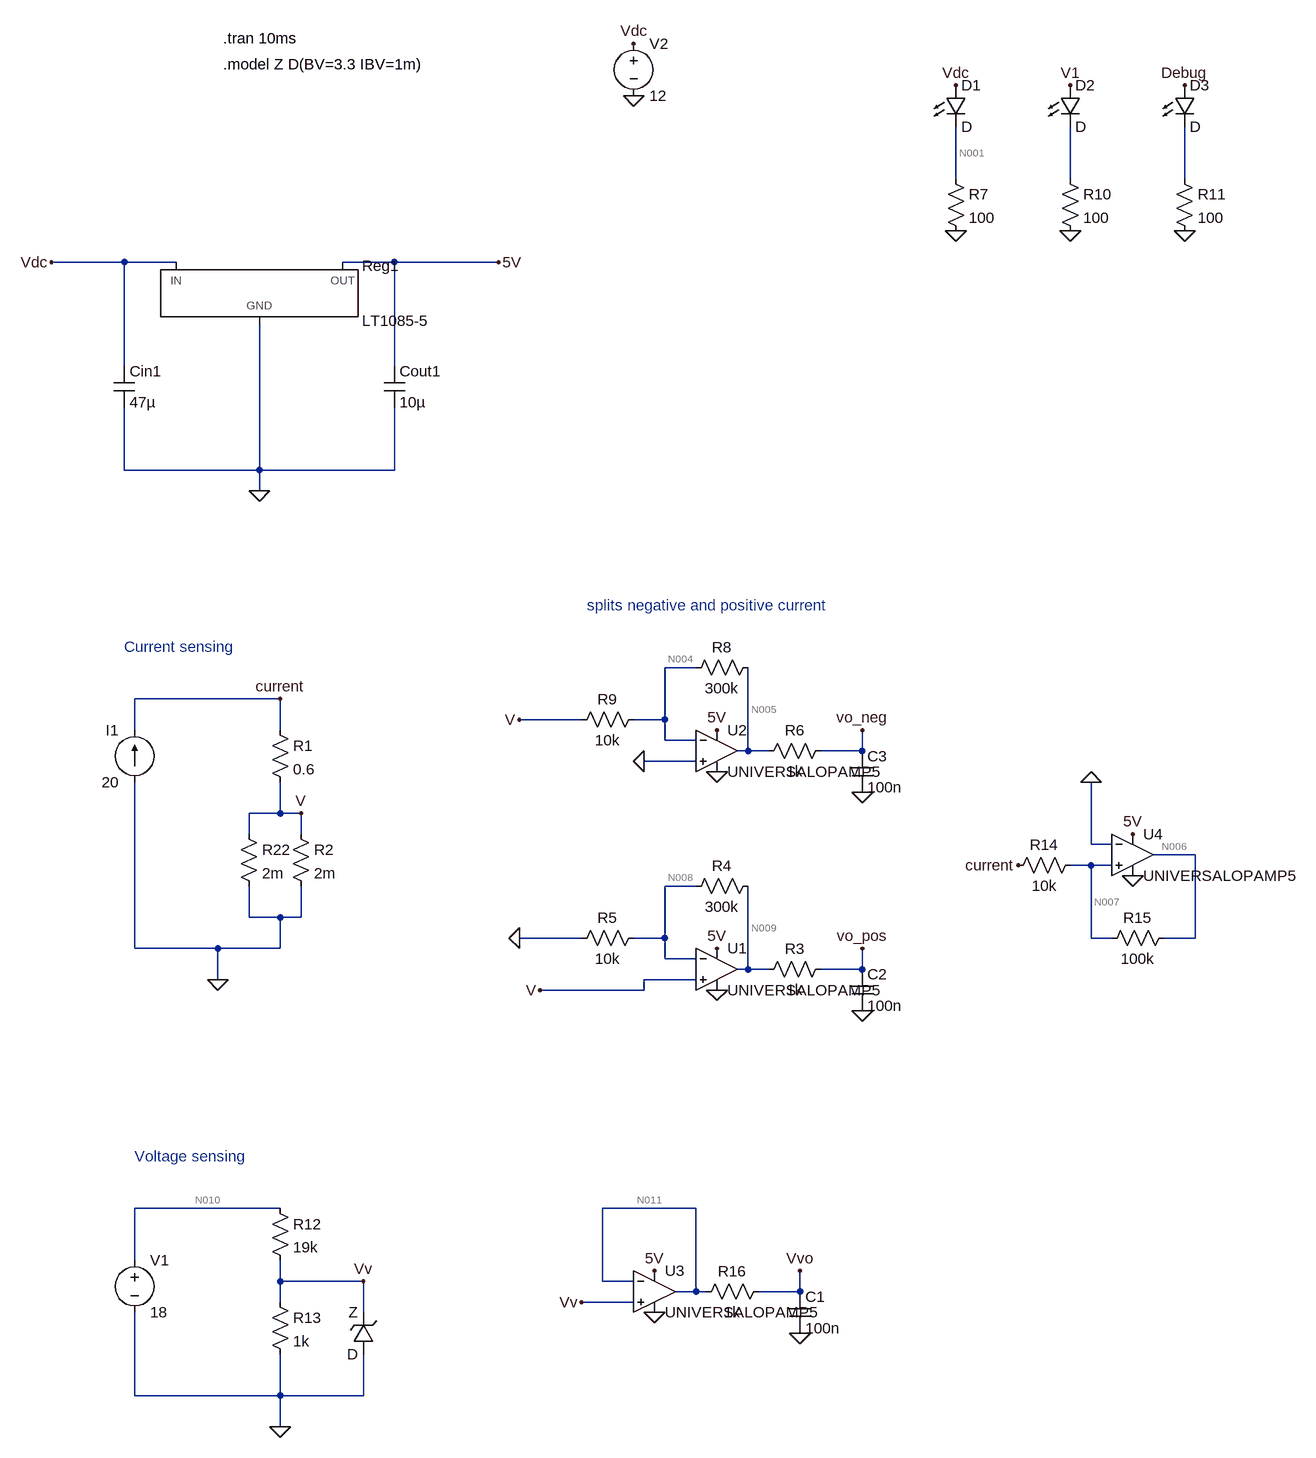
[diagram p0: schematic Splits_negative_positive.asc]
Splits_negative_positive.asc, the LTspice schematic file:
Version 4
SHEET 1 2388 1060
WIRE 688 -880 688 -960
WIRE 864 -880 864 -960
WIRE 1040 -880 1040 -960
WIRE -592 -752 -704 -752
WIRE -512 -752 -592 -752
WIRE -176 -752 -256 -752
WIRE -16 -752 -176 -752
WIRE -592 -592 -592 -752
WIRE -176 -592 -176 -752
WIRE -592 -432 -592 -528
WIRE -384 -432 -384 -656
WIRE -384 -432 -592 -432
WIRE -176 -432 -176 -528
WIRE -176 -432 -384 -432
WIRE -384 -400 -384 -432
WIRE 288 -128 240 -128
WIRE -352 -80 -576 -80
WIRE 112 -48 16 -48
WIRE 240 -48 240 -128
WIRE 240 -48 192 -48
WIRE -576 -32 -576 -80
WIRE -352 -32 -352 -80
WIRE 240 -16 240 -48
WIRE 288 -16 240 -16
WIRE 368 0 368 -128
WIRE 368 0 352 0
WIRE 400 0 368 0
WIRE 544 0 544 -32
WIRE 544 0 480 0
WIRE 288 16 208 16
WIRE -352 96 -352 48
WIRE -352 96 -400 96
WIRE -320 96 -352 96
WIRE -400 128 -400 96
WIRE -320 128 -320 96
WIRE 896 144 896 48
WIRE 928 144 896 144
WIRE 1056 160 992 160
WIRE 896 176 864 176
WIRE 928 176 896 176
WIRE 288 208 240 208
WIRE -400 256 -400 208
WIRE -352 256 -400 256
WIRE -320 256 -320 208
WIRE -320 256 -352 256
WIRE 112 288 16 288
WIRE 240 288 240 208
WIRE 240 288 192 288
WIRE 896 288 896 176
WIRE 928 288 896 288
WIRE 1056 288 1056 160
WIRE 1056 288 1008 288
WIRE -576 304 -576 48
WIRE -448 304 -576 304
WIRE -352 304 -352 256
WIRE -352 304 -448 304
WIRE 240 320 240 288
WIRE 288 320 240 320
WIRE 368 336 368 208
WIRE 368 336 352 336
WIRE 400 336 368 336
WIRE 544 336 544 304
WIRE 544 336 480 336
WIRE -448 352 -448 304
WIRE 288 352 208 352
WIRE 208 368 208 352
WIRE 208 368 48 368
WIRE -352 704 -576 704
WIRE 288 704 144 704
WIRE -576 784 -576 704
WIRE -352 816 -352 784
WIRE -224 816 -352 816
WIRE 144 816 144 704
WIRE 192 816 144 816
WIRE 288 832 288 704
WIRE 288 832 256 832
WIRE 304 832 288 832
WIRE 448 832 448 800
WIRE 448 832 384 832
WIRE -352 848 -352 816
WIRE 192 848 112 848
WIRE -224 864 -224 816
WIRE -576 992 -576 864
WIRE -352 992 -352 928
WIRE -352 992 -576 992
WIRE -224 992 -224 928
WIRE -224 992 -352 992
WIRE -352 1040 -352 992
FLAG -448 352 0
FLAG -320 96 V
FLAG 16 288 0
FLAG 48 368 V
FLAG 320 368 0
FLAG 320 304 5V
FLAG 544 304 vo_pos
FLAG 320 32 0
FLAG 320 -32 5V
FLAG 544 -32 vo_neg
FLAG -224 816 Vv
FLAG 112 848 Vv
FLAG 224 864 0
FLAG 224 800 5V
FLAG 448 896 0
FLAG 448 800 Vvo
FLAG 208 16 0
FLAG 16 -48 V
FLAG 544 400 0
FLAG 544 64 0
FLAG -16 -752 5V
FLAG -704 -752 Vdc
FLAG 192 -1008 0
FLAG 192 -1088 Vdc
FLAG -384 -400 0
FLAG -352 1040 0
FLAG 688 -800 0
FLAG 688 -1024 Vdc
FLAG 864 -800 0
FLAG 864 -1024 V1
FLAG 1040 -800 0
FLAG 1040 -1024 Debug
FLAG 960 192 0
FLAG 960 128 5V
FLAG 896 48 0
FLAG 784 176 current
FLAG -352 -80 current
SYMBOL voltage -576 768 R0
WINDOW 123 0 0 Left 0
WINDOW 39 0 0 Left 0
SYMATTR InstName V1
SYMATTR Value 18
SYMBOL res -368 -48 R0
SYMATTR InstName R1
SYMATTR Value 0.6
SYMBOL res -336 112 R0
SYMATTR InstName R2
SYMATTR Value 2m
SYMBOL res 384 192 R90
WINDOW 0 0 56 VBottom 2
WINDOW 3 32 56 VTop 2
SYMATTR InstName R4
SYMATTR Value 300k
SYMBOL res 208 272 R90
WINDOW 0 0 56 VBottom 2
WINDOW 3 32 56 VTop 2
SYMATTR InstName R5
SYMATTR Value 10k
SYMBOL OpAmps\\UniversalOpAmp5 320 336 R0
SYMATTR InstName U1
SYMBOL res 384 -144 R90
WINDOW 0 0 56 VBottom 2
WINDOW 3 32 56 VTop 2
SYMATTR InstName R8
SYMATTR Value 300k
SYMBOL res 208 -64 R90
WINDOW 0 0 56 VBottom 2
WINDOW 3 32 56 VTop 2
SYMATTR InstName R9
SYMATTR Value 10k
SYMBOL OpAmps\\UniversalOpAmp5 320 0 R0
SYMATTR InstName U2
SYMBOL res -368 688 R0
SYMATTR InstName R12
SYMATTR Value 19k
SYMBOL res -368 832 R0
SYMATTR InstName R13
SYMATTR Value 1k
SYMBOL OpAmps\\UniversalOpAmp5 224 832 R0
SYMATTR InstName U3
SYMBOL res 400 816 R90
WINDOW 0 0 56 VBottom 2
WINDOW 3 32 56 VTop 2
SYMATTR InstName R16
SYMATTR Value 1k
SYMBOL cap 432 832 R0
SYMATTR InstName C1
SYMATTR Value 100n
SYMBOL res -416 112 R0
SYMATTR InstName R22
SYMATTR Value 2m
SYMBOL zener -208 928 R180
WINDOW 0 24 64 Left 2
WINDOW 3 24 0 Left 2
SYMATTR InstName Z
SYMBOL current -576 48 R180
WINDOW 0 24 80 Left 2
WINDOW 3 24 0 Left 2
WINDOW 123 0 0 Left 0
WINDOW 39 0 0 Left 0
SYMATTR InstName I1
SYMATTR Value 20
SYMBOL res 496 320 R90
WINDOW 0 0 56 VBottom 2
WINDOW 3 32 56 VTop 2
SYMATTR InstName R3
SYMATTR Value 1k
SYMBOL cap 528 336 R0
SYMATTR InstName C2
SYMATTR Value 100n
SYMBOL res 496 -16 R90
WINDOW 0 0 56 VBottom 2
WINDOW 3 32 56 VTop 2
SYMATTR InstName R6
SYMATTR Value 1k
SYMBOL cap 528 0 R0
SYMATTR InstName C3
SYMATTR Value 100n
SYMBOL PowerProducts/LT1085-5 -384 -752 R0
SYMATTR InstName Reg1
SYMBOL cap -608 -592 R0
SYMATTR InstName Cin1
SYMATTR Value 47µ
SYMATTR SpiceLine Rser=0.001
SYMBOL cap -192 -592 R0
SYMATTR InstName Cout1
SYMATTR Value 10µ
SYMATTR SpiceLine Rser=0.001
SYMBOL voltage 192 -1104 R0
WINDOW 123 0 0 Left 0
WINDOW 39 0 0 Left 0
SYMATTR InstName V2
SYMATTR Value 12
SYMBOL LED 672 -1024 R0
SYMATTR InstName D1
SYMBOL res 672 -896 R0
SYMATTR InstName R7
SYMATTR Value 100
SYMBOL LED 848 -1024 R0
SYMATTR InstName D2
SYMBOL res 848 -896 R0
SYMATTR InstName R10
SYMATTR Value 100
SYMBOL LED 1024 -1024 R0
SYMATTR InstName D3
SYMBOL res 1024 -896 R0
SYMATTR InstName R11
SYMATTR Value 100
SYMBOL OpAmps\\UniversalOpAmp5 960 160 R0
SYMATTR InstName U4
SYMBOL res 880 160 R90
WINDOW 0 0 56 VBottom 2
WINDOW 3 32 56 VTop 2
SYMATTR InstName R14
SYMATTR Value 10k
SYMBOL res 1024 272 R90
WINDOW 0 0 56 VBottom 2
WINDOW 3 32 56 VTop 2
SYMATTR InstName R15
SYMATTR Value 100k
TEXT -440 -1096 Left 2 !.tran 10ms
TEXT 120 -224 Left 2 ;splits negative and positive current
TEXT -440 -1056 Left 2 !.model Z D(BV=3.3 IBV=1m)
TEXT -576 624 Left 2 ;Voltage sensing
TEXT -592 -160 Left 2 ;Current sensing

The netlist it stands for:
* Splits_negative_positive.asc
V1 N010 0 18
R1 current V 0.6
R2 V 0 2m
R4 N009 N008 300k
R5 N008 0 10k
XU1 V N008 5V 0 N009 level5 Avol=1Meg GBW=10Meg Phimargin=45 SlewPos=10Meg SlewNeg=10Meg En=0 Enk=0 In=0 Ink=0 Rcm=500Meg Ccm=1p Rdiff=500k Cdiff=2p Ro=1k Vos=0 Ibp=2n Ibn=1n Iq=1m Rail=0 Ilimit=25m  ; UNIVERSALOPAMP5, pins In+ In- V+ V- OUT
R8 N005 N004 300k
R9 N004 V 10k
XU2 0 N004 5V 0 N005 level5 Avol=1Meg GBW=10Meg Phimargin=45 SlewPos=10Meg SlewNeg=10Meg En=0 Enk=0 In=0 Ink=0 Rcm=500Meg Ccm=1p Rdiff=500k Cdiff=2p Ro=1k Vos=0 Ibp=2n Ibn=1n Iq=1m Rail=0 Ilimit=25m  ; UNIVERSALOPAMP5, pins In+ In- V+ V- OUT
R12 N010 Vv 19k
R13 Vv 0 1k
XU3 Vv N011 5V 0 N011 level5 Avol=1Meg GBW=10Meg Phimargin=45 SlewPos=10Meg SlewNeg=10Meg En=0 Enk=0 In=0 Ink=0 Rcm=500Meg Ccm=1p Rdiff=500k Cdiff=2p Ro=1k Vos=0 Ibp=2n Ibn=1n Iq=1m Rail=0 Ilimit=25m  ; UNIVERSALOPAMP5, pins In+ In- V+ V- OUT
R16 Vvo N011 1k
C1 Vvo 0 100n
R22 V 0 2m
D§Z 0 Vv D
I1 0 current 20
R3 vo_pos N009 1k
C2 vo_pos 0 100n
R6 vo_neg N005 1k
C3 vo_neg 0 100n
XReg1 0 5V Vdc LT1085-5  ; pins GND OUT IN
Cin1 Vdc 0 47µ Rser=0.001
Cout1 5V 0 10µ Rser=0.001
V2 Vdc 0 12
D1 Vdc N001 D
R7 N001 0 100
D2 V1 N002 D
R10 N002 0 100
D3 Debug N003 D
R11 N003 0 100
XU4 N007 0 5V 0 N006 level5 Avol=1Meg GBW=10Meg Phimargin=45 SlewPos=10Meg SlewNeg=10Meg En=0 Enk=0 In=0 Ink=0 Rcm=500Meg Ccm=1p Rdiff=500k Cdiff=2p Ro=1k Vos=0 Ibp=2n Ibn=1n Iq=1m Rail=0 Ilimit=25m  ; UNIVERSALOPAMP5, pins In+ In- V+ V- OUT
R14 N007 current 10k
R15 N006 N007 100k
.model D D
.lib standard.dio
.tran 10ms
* splits negative and positive current
.model Z D(BV=3.3 IBV=1m)
* Voltage sensing
* Current sensing
.backanno
.end

* Results of the author's LTspice run, read from the files saved beside the schematic
* Operating Point, zero values left out:
*   V(n010) = 18 V
*   V(current) = 12.02 V
*   V(v) = 20 mV
*   V(n009) = 618.9 mV
*   V(n008) = 20 mV
*   V(5v) = 5.003 V
*   V(n005) = 432.8 µV
*   V(n004) = 19.04 mV
*   V(vv) = 900 mV
*   V(n011) = 900 mV
*   V(vvo) = 900 mV
*   V(vo_pos) = 618.9 mV
*   V(vo_neg) = 432.8 µV
*   V(vdc) = 12 V
*   V(n001) = 11.22 V
*   V(n007) = 11.18 V
*   V(n006) = 5.003 V
*   I(D1) = 112.2 mA
*   I(I1) = 20 A
*   I(R1) = 20 A
*   I(R2) = 10 A
*   I(R4) = 1.996 µA
*   I(R5) = 2 µA
*   I(R8) = -62.02 nA
*   I(R9) = -96.13 nA
*   I(R12) = 900 µA
*   I(R13) = 900 µA
*   I(R22) = 10 A
*   I(R7) = 112.2 mA
*   I(R14) = -84.14 µA
*   I(R15) = -61.76 µA
*   I(V1) = -900 µA
*   I(V2) = -121.4 mA